# EAGLE schematic Design_Schematic (EAGLE 7.4.0)
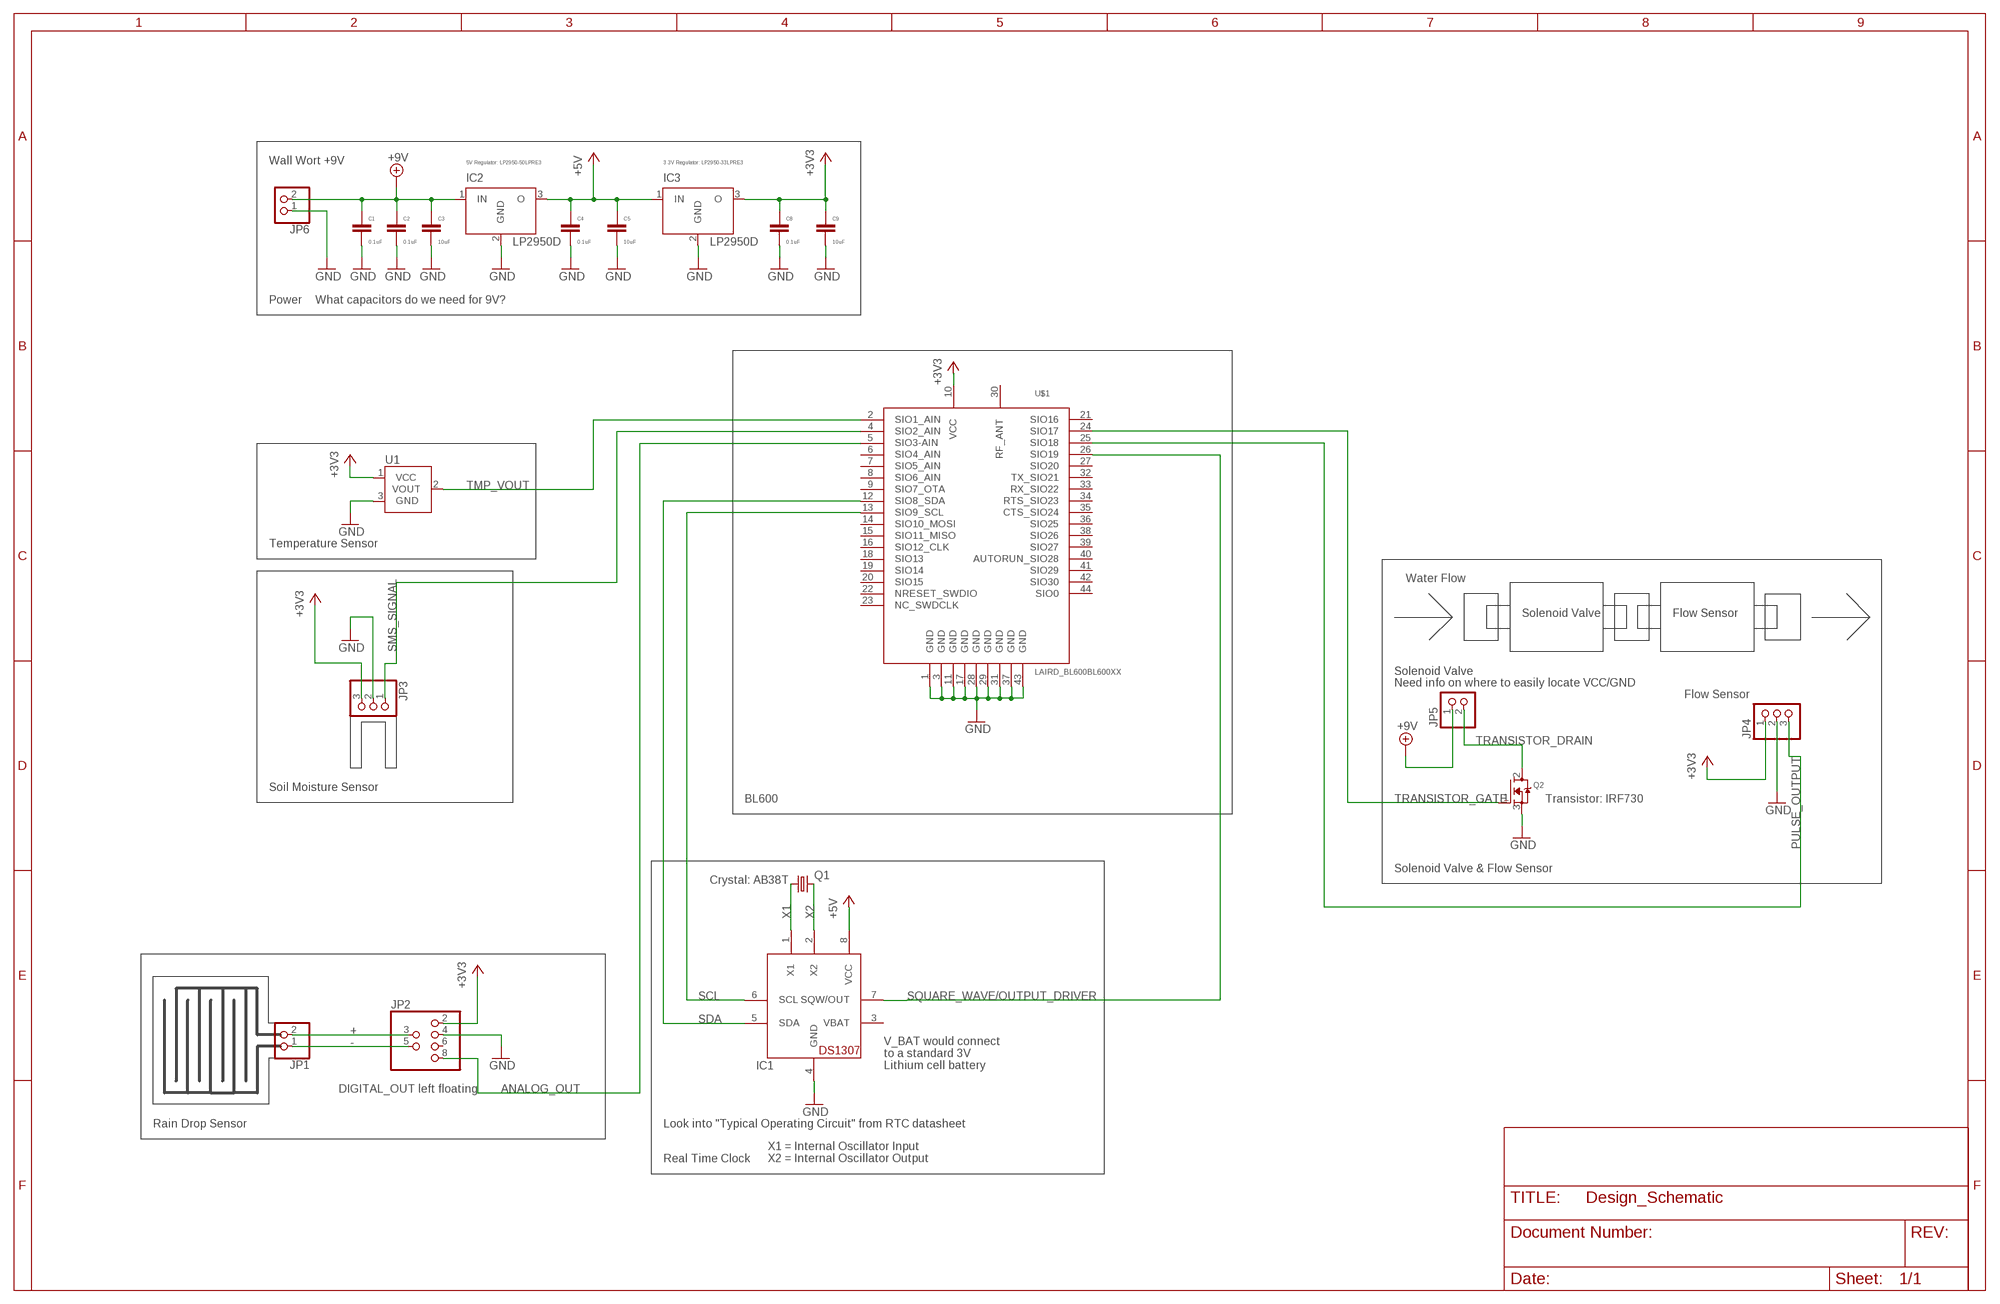
[diagram p0: schematic, sheet 1]

## Parts
C1  0.1uF  C-EUC0805  [C0805]
C2  0.1uF  C-EUC0805  [C0805]
C3  10uF  C-EUC0805  [C0805]
C4  0.1uF  C-EUC0805  [C0805]
C5  10uF  C-EUC0805  [C0805]
C8  0.1uF  C-EUC0805  [C0805]
C9  10uF  C-EUC0805  [C0805]
IC1  DS1307  [DIL08]
IC2  LP2950D  [TO252]
IC3  LP2950D  [TO252]
JP1  PINHD-1X2  [1X02]
JP2  PINHD-2X4  [2X04]
JP3  PINHD-1X3  [1X03]
JP4  PINHD-1X3  [1X03]
JP5  PINHD-1X2  [1X02]
JP6  PINHD-1X2  [1X02]
Q1  CRYSTALTC38H  [TC38H]
Q2  MOSFET-NGDS_TO220V  [TO220V]
U1  TMP36GT9  [TO-92]
U$1  LAIRD_BL600BL600XX  [BL600]

## Nets
+: JP1.2 JP2.3
+3V3: C8.1 C9.1 IC3.3(O) JP2.2 JP3.3 JP4.1 U1.1(VCC) U$1.10(VCC)
+5V: C4.1 C5.1 IC1.8(VCC) IC2.3(O) IC3.1(IN)
+9V: C1.1 C2.1 C3.1 IC2.1(IN) JP5.1 JP6.2
-: JP1.1 JP2.5
ANALOG_OUT: JP2.8 U$1.5(SIO3-AIN)
GND: C1.2 C2.2 C3.2 C4.2 C5.2 C8.2 C9.2 IC1.4(GND) IC2.2(GND) IC3.2(GND) JP2.4 JP3.2 JP4.2 JP6.1 Q2.3(S) U1.3(GND) U$1.1(GND) U$1.3(GND) U$1.11(GND) U$1.17(GND) U$1.28(GND) U$1.29(GND) U$1.31(GND) U$1.37(GND) U$1.43(GND)
N$3: JP4.3 U$1.25(SIO18)
SCL: IC1.6(SCL) U$1.13(SIO9_SCL)
SDA: IC1.5(SDA) U$1.12(SIO8_SDA)
SMS_SIGNAL: JP3.1 U$1.4(SIO2_AIN)
SQUARE_WAVE: IC1.7(SQW/OUT) U$1.26(SIO19)
TMP_VOUT: U1.2(VOUT) U$1.2(SIO1_AIN)
TRANSISTOR_DRAIN: JP5.2 Q2.2(D)
TRANSISTOR_GATE: Q2.1(G) U$1.24(SIO17)
X1: IC1.1(X1) Q1.1
X2: IC1.2(X2)
Unconnected: JP2.6 Q1.2 U$1.6(SIO4_AIN) U$1.7(SIO5_AIN) U$1.8(SIO6_AIN) U$1.9(SIO7_OTA) U$1.14(SIO10_MOSI) U$1.15(SIO11_MISO) U$1.16(SIO12_CLK) U$1.18(SIO13) U$1.19(SIO14) U$1.20(SIO15) U$1.21(SIO16) U$1.22(NRESET_SWDIO) U$1.23(NC_SWDCLK) U$1.27(SIO20) U$1.30(RF_ANT) U$1.32(TX_SIO21) U$1.33(RX_SIO22) U$1.34(RTS_SIO23) U$1.35(CTS_SIO24) U$1.36(SIO25) U$1.38(SIO26) U$1.39(SIO27) U$1.40(AUTORUN_SIO28) U$1.41(SIO29) U$1.42(SIO30) U$1.44(SIO0)

## Notes on the sheet
- Wall Wort +9V | 5V Regulator: LP2950-50LPRE3 | 3.3V Regulator: LP2950-33LPRE3
- Power | What capacitors do we need for 9V?
- TMP_VOUT
- Temperature Sensor
- Water Flow
- Solenoid Valve | Flow Sensor
- SMS_SIGNAL
- Solenoid Valve
- Need info on where to easily locate VCC/GND
- Flow Sensor
- TRANSISTOR_DRAIN
- Soil Moisture Sensor
- BL600 | TRANSISTOR_GATE | Transistor: IRF730
- PULSE_OUTPUT
- Solenoid Valve & Flow Sensor
- Crystal: AB38T
- X1 | X2
- SCL | SQUARE_WAVE/OUTPUT_DRIVER
- SDA
- +
- -
- V_BAT would connect
  to a standard 3V
  Lithium cell battery
- DIGITAL_OUT left floating | ANALOG_OUT
- Rain Drop Sensor | Look into "Typical Operating Circuit" from RTC datasheet
- Real Time Clock
- X1 = Internal Oscillator Input
  X2 = Internal Oscillator Output

## Power pins joined to a net without a drawn wire
VBAT: IC1.3(VBAT)

## Library data of the parts
C1-C5 C8 C9 = rcl:C-EU: CAPACITOR, European symbol
IC1 = adafruit:DS1307: DS1307 Real time clock (RTC) with battery backup ability. Talk to it via i2c
IC2 IC3 = national-semiconductor:LP2950: Adjustable Micropower Voltage Regulator PIN-Connection corrected by http://www.ti.com/lit/ds/symlink/lp2950-n.pdf; MF: NATIONAL SEMICONDUCTOR; MPN: LP2950CDT-5.0/NOPB; OC_FARNELL: 1469117; OC_NEWARK: 41K6539
JP1 JP5 JP6 = pinhead:PINHD-1X2: PIN HEADER
JP2 = Rain-Drop-Sensor:PINHD-2X4: 2-and-4 Pin Header
JP3 JP4 = pinhead:PINHD-1X3: PIN HEADER
Q1 = crystal:CRYSTAL: CRYSTAL; OC_FARNELL: unknown; OC_NEWARK: unknown
Q2 = adafruit:MOSFET-N: N-Channel Mosfet 2N7002E - 60V 260mA SOT23 [Digikey: 2N7002ET1GOSTR-ND] - REEL BSH103 - 30V 850mA SOT23 [Digikey: 568-5013-1-ND]
U1 = SparkFun-Sensors:TMP36: Precision degC temp sensor, analog out
U$1 = BL600:LAIRD_BL600